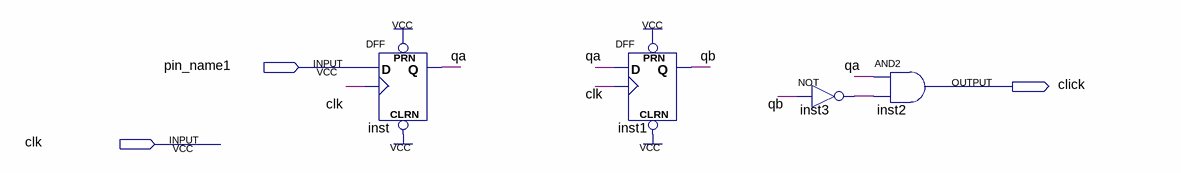
[diagram p0: schematic sheet]
// Quartus schematic debounce2.bdf as structural Verilog: 4 symbols, 3 pins
module debounce2 (
  input  pin_name1,
  input  clk,
  output click
);

  wire inst3_out, qa, qb;

  DFF inst (.CLRN(1'b1), .CLK(clk), .D(pin_name1), .PRN(1'b1), .Q(qa));
  DFF inst1 (.CLRN(1'b1), .CLK(clk), .D(qa), .PRN(1'b1), .Q(qb));
  not inst3 (inst3_out, qb);
  and inst2 (click, qa, inst3_out);
endmodule
